# EAGLE design md_ver10.4 (EAGLE 6.4)
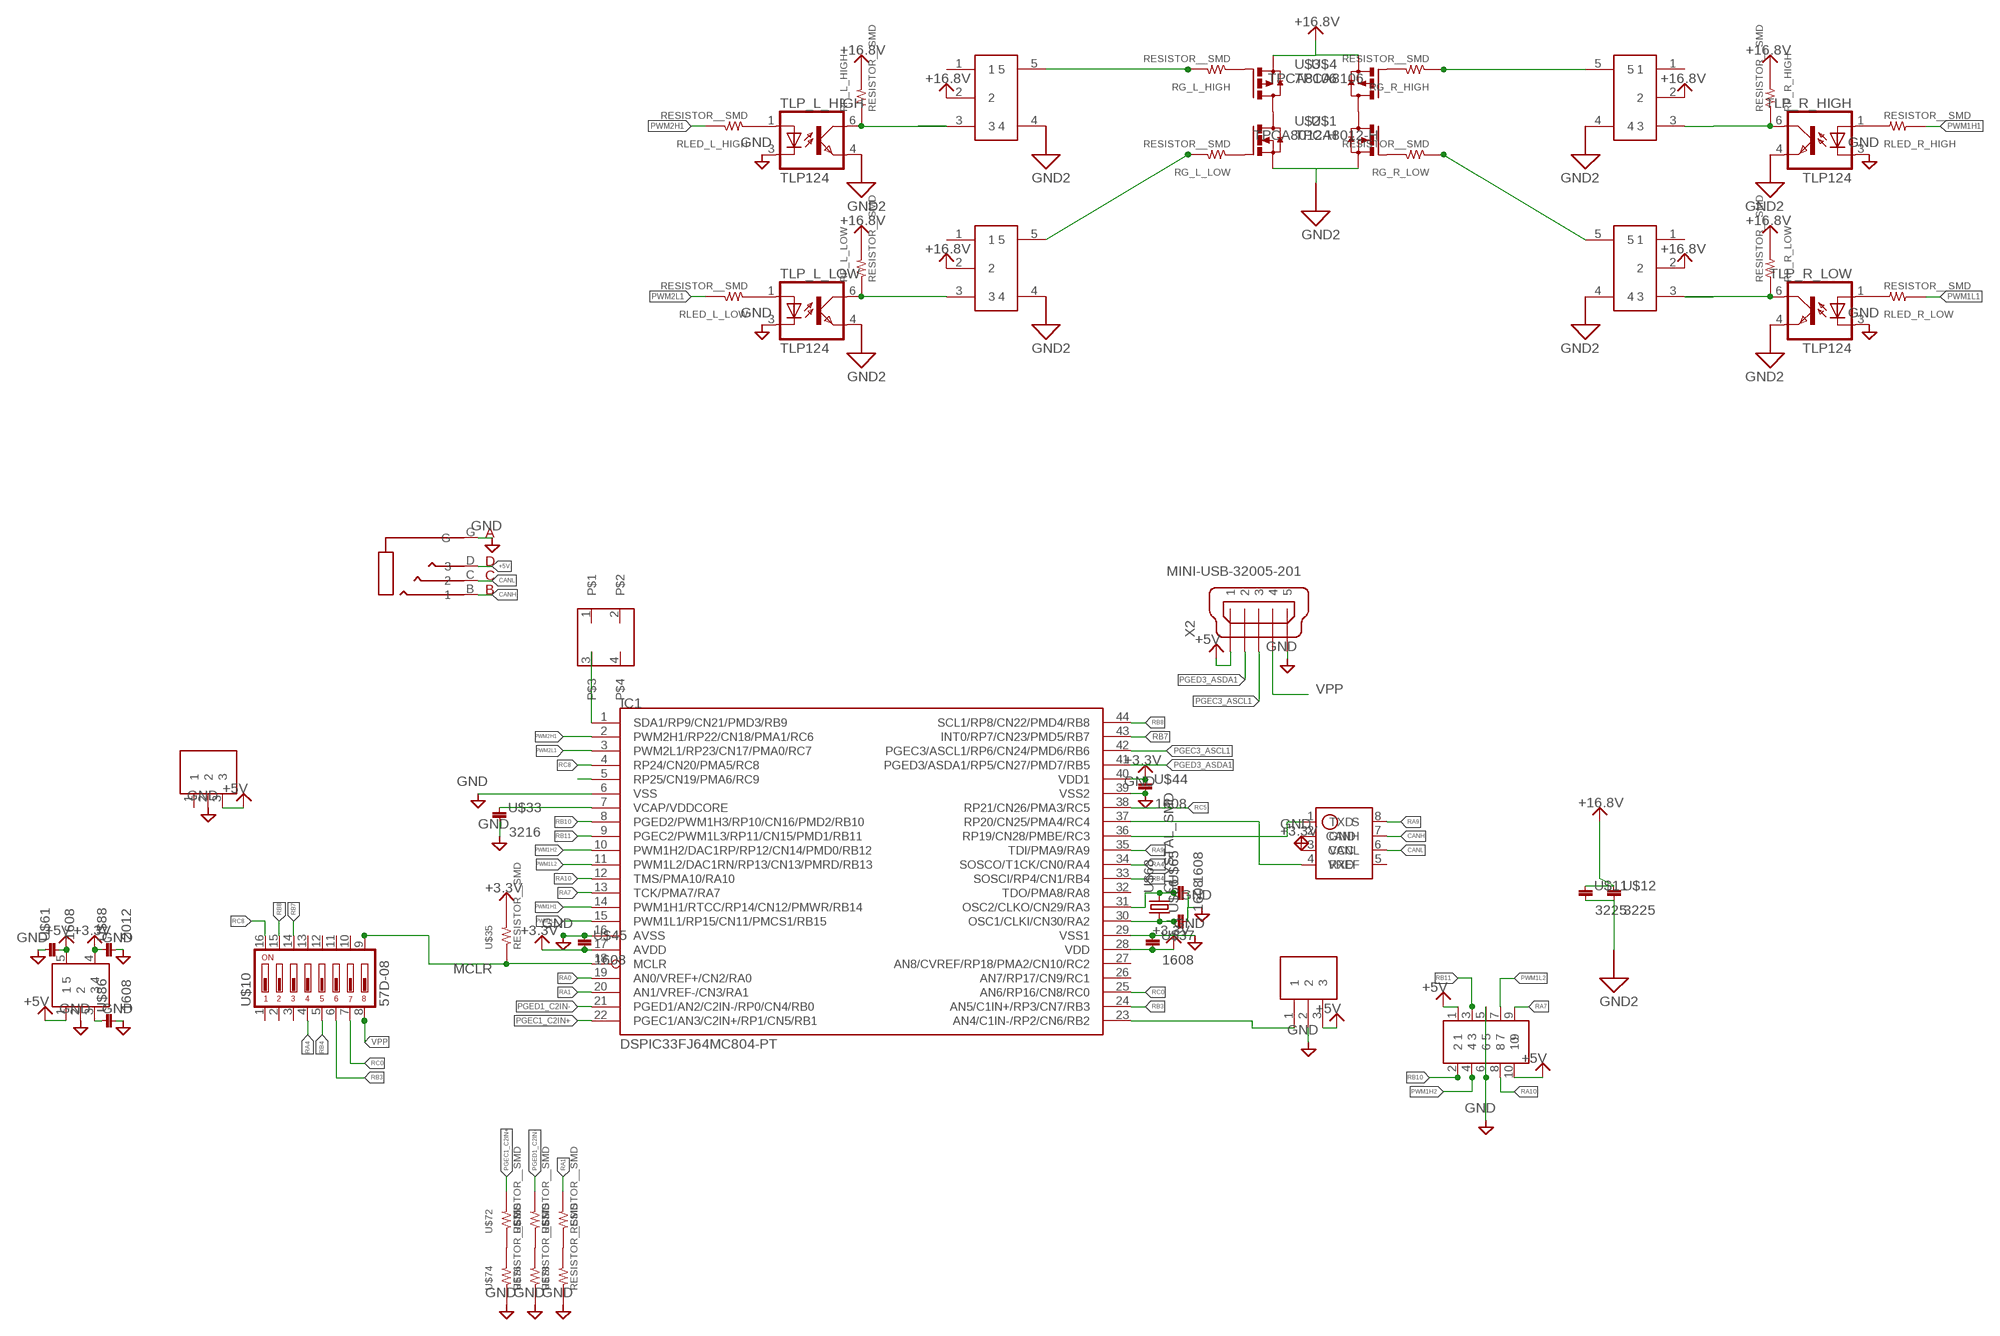
[diagram p0: schematic, sheet 1]

## Parts
IC1  DSPIC33FJ64MC804-PT  [TQFP44]
IC_L_HIGH  MCP1415  [SOT23-5L]
IC_L_LOW  MCP1415  [SOT23-5L]
IC_R_HIGH  MCP1415  [SOT23-5L]
IC_R_LOW  MCP1415  [SOT23-5L]
RG_L_HIGH  RESISTOR__SMD  [1608]
RG_L_LOW  RESISTOR__SMD  [1608]
RG_R_HIGH  RESISTOR__SMD  [1608]
RG_R_LOW  RESISTOR__SMD  [1608]
RLED_L_HIGH  RESISTOR__SMD  [1608]
RLED_L_LOW  RESISTOR__SMD  [1608]
RLED_R_HIGH  RESISTOR__SMD  [1608]
RLED_R_LOW  RESISTOR__SMD  [1608]
RP_L_HIGH  RESISTOR__SMD  [1608]
RP_L_LOW  RESISTOR__SMD  [1608]
RP_R_HIGH  RESISTOR__SMD  [1608]
RP_R_LOW  RESISTOR__SMD  [1608]
TLP_L_HIGH  TLP124  [11−4C1]
TLP_L_LOW  TLP124  [11−4C1]
TLP_R_HIGH  TLP124  [11−4C1]
TLP_R_LOW  TLP124  [11−4C1]
U$1  TPCA8012-H  [2-5Q1A]
U$2  TPCA8012-H  [2-5Q1A]
U$3  TPCA8106  [2-5Q1A]
U$4  TPCA8106  [2-5Q1A]
U$7  ＰＬ－ＩＲＭ  [ＰＬ－ＩＲＭ]
U$8  Ｒ－７８Ｅ５．０  [Ｒ－７８Ｅ５．０]
U$9  TAR5SB  [SSOP5-P-0.95]
U$10  57D-08  [57D]
U$11  3225  [3225]
U$12  3225  [3225]
U$15  PIN_HEADER_52  [PIN_HEADER_5*2]
U$33  3216  [3216]
U$35  RESISTOR__SMD  [1608]
U$37  1608  [1608]
U$44  1608  [1608]
U$45  1608  [1608]
U$61  1608  [1608]
U$64  AUDIO4  [AUDIO4_MJ]
U$65  1608  [1608]
U$66  1608  [1608]
U$68  CLYSTAL_SMD  [CRYSTAL_SMD]
U$69  TACT  [TL1105]
U$72  RESISTOR__SMD  [1608]
U$74  RESISTOR__SMD  [1608]
U$75  RESISTOR__SMD  [1608]
U$76  RESISTOR__SMD  [1608]
U$77  RESISTOR__SMD  [1608]
U$78  RESISTOR__SMD  [1608]
U$82  SN65HVD1050  [SOIC8]
U$86  1608  [1608]
U$88  2012  [2012]
X2  MINI-USB-32005-201  [32005-201]

## Nets
+3.3V: IC1.17(AVDD) IC1.28(VDD) IC1.40(VDD1) U$9.4 U$35.2 U$37.P$2 U$44.P$1 U$45.P$2 U$82.3(VCC) U$88.1
+5V: U$7.3 U$8.3 U$9.1 U$9.5 U$15.1 U$15.10 U$61.P$2 U$64.D X2.1
+16.8V: IC_L_HIGH.2 IC_L_LOW.2 IC_R_HIGH.2 IC_R_LOW.2 RP_L_HIGH.2 RP_L_LOW.2 RP_R_HIGH.2 RP_R_LOW.2 U$3.1(S) U$3.2(S) U$3.3(S) U$4.1(S) U$4.2(S) U$4.3(S) U$11.P$1 U$12.P$1
CANH: U$64.B U$82.7(CANH)
CANL: U$64.C U$82.6(CANL)
GND: IC1.6(VSS) IC1.16(AVSS) IC1.29(VSS1) IC1.39(VSS2) TLP_L_HIGH.3(C) TLP_L_LOW.3(C) TLP_R_HIGH.3(C) TLP_R_LOW.3(C) U$7.2 U$8.2 U$9.2 U$15.5 U$15.6 U$33.P$2 U$37.P$1 U$44.P$2 U$45.P$1 U$61.P$1 U$64.G U$65.P$2 U$66.P$2 U$74.1 U$76.1 U$78.1 U$82.2(GND) U$86.P$2 U$88.2 X2.5
GND2: IC_L_HIGH.4 IC_L_LOW.4 IC_R_HIGH.4 IC_R_LOW.4 TLP_L_HIGH.4(EMIT) TLP_L_LOW.4(EMIT) TLP_R_HIGH.4(EMIT) TLP_R_LOW.4(EMIT) U$1.1(S) U$1.2(S) U$1.3(S) U$2.1(S) U$2.2(S) U$2.3(S) U$11.P$2 U$12.P$2
M1: U$2.5(D) U$2.6(D) U$2.7(D) U$2.8(D) U$3.5(D) U$3.6(D) U$3.7(D) U$3.8(D)
M2: U$1.5(D) U$1.6(D) U$1.7(D) U$1.8(D) U$4.5(D) U$4.6(D) U$4.7(D) U$4.8(D)
MCLR: IC1.18(MCLR) U$10.9 U$35.1
N$1: RG_L_LOW.1 U$2.4(G)
N$2: U$9.3 U$86.P$1
N$3: RLED_L_LOW.1 TLP_L_LOW.1(A)
N$4: RG_R_LOW.2 U$1.4(G)
N$5: IC_L_LOW.5 RG_L_LOW.2
N$6: IC_L_LOW.3 RP_L_LOW.1 TLP_L_LOW.6(COL)
N$7: IC_R_LOW.5 RG_R_LOW.1
N$9: RLED_R_LOW.1 TLP_R_LOW.1(A)
N$11: IC_L_HIGH.3 RP_L_HIGH.1 TLP_L_HIGH.6(COL)
N$12: RLED_L_HIGH.1 TLP_L_HIGH.1(A)
N$14: IC_L_HIGH.5 RG_L_HIGH.2
N$15: IC_R_HIGH.3 RP_R_HIGH.1 TLP_R_HIGH.6(COL)
N$16: RLED_R_HIGH.1 TLP_R_HIGH.1(A)
N$17: IC1.23(AN4/C1IN-/RP2/CN6/RB2) U$7.1
N$18: IC_R_HIGH.5 RG_R_HIGH.1
N$19: RG_L_HIGH.1 U$3.4(G)
N$20: RG_R_HIGH.2 U$4.4(G)
N$21: U$72.1 U$74.2
N$22: IC1.30(OSC1/CLKI/CN30/RA2) U$66.P$1 U$68.1
N$23: IC1.31(OSC2/CLKO/CN29/RA3) U$65.P$1 U$68.2
N$24: U$75.1 U$76.2
N$25: U$77.1 U$78.2
N$26: IC1.1(SDA1/RP9/CN21/PMD3/RB9) U$69.3
N$27: IC1.36(RP19/CN28/PMBE/RC3) U$82.1(TXD)
N$28: IC1.5(RP25/CN19/PMA6/RC9)
N$30: IC1.37(RP20/CN25/PMA4/RC4) U$82.4(RXD)
PGEC1_C2IN+: IC1.22(PGEC1/AN3/C2IN+/RP1/CN5/RB1) U$72.2
PGEC3_ASCL1: IC1.42(PGEC3/ASCL1/RP6/CN24/PMD6/RB6) X2.3
PGED1_C2IN-: IC1.21(PGED1/AN2/C2IN-/RP0/CN4/RB0) U$75.2
PGED3_ASDA1: IC1.41(PGED3/ASDA1/RP5/CN27/PMD7/RB5) X2.2
PWM1H1: IC1.14(PWM1H1/RTCC/RP14/CN12/PMWR/RB14) RLED_R_HIGH.2
PWM1H2: IC1.10(PWM1H2/DAC1RP/RP12/CN14/PMD0/RB12) U$15.4
PWM1L1: IC1.15(PWM1L1/RP15/CN11/PMCS1/RB15) RLED_R_LOW.2
PWM1L2: IC1.11(PWM1L2/DAC1RN/RP13/CN13/PMRD/RB13) U$15.7
PWM2H1: IC1.2(PWM2H1/RP22/CN18/PMA1/RC6) RLED_L_HIGH.2
PWM2L1: IC1.3(PWM2L1/RP23/CN17/PMA0/RC7) RLED_L_LOW.2
RA0: IC1.19(AN0/VREF+/CN2/RA0)
RA1: IC1.20(AN1/VREF-/CN3/RA1) U$77.2
RA4: IC1.34(SOSCO/T1CK/CN0/RA4) U$10.4
RA7: IC1.13(TCK/PMA7/RA7) U$15.9
RA9: IC1.35(TDI/PMA9/RA9) U$82.8(S)
RA10: IC1.12(TMS/PMA10/RA10) U$15.8
RB3: IC1.24(AN5/C1IN+/RP3/CN7/RB3) U$10.6
RB4: IC1.33(SOSCI/RP4/CN1/RB4) U$10.5
RB7: IC1.43(INT0/RP7/CN23/PMD5/RB7) U$10.14
RB8: IC1.44(SCL1/RP8/CN22/PMD4/RB8) U$10.15
RB10: IC1.8(PGED2/PWM1H3/RP10/CN16/PMD2/RB10) U$15.2
RB11: IC1.9(PGEC2/PWM1L3/RP11/CN15/PMD1/RB11) U$15.3
RC0: IC1.25(AN6/RP16/CN8/RC0) U$10.7
RC5: IC1.38(RP21/CN26/PMA3/RC5)
RC8: IC1.4(RP24/CN20/PMA5/RC8) U$10.16
TLP_R_LOW: IC_R_LOW.3 RP_R_LOW.1 TLP_R_LOW.6(COL)
VCAP/VDDCORE: IC1.7(VCAP/VDDCORE) U$33.P$1
VPP: U$10.8 X2.4
Unconnected: IC1.26(AN7/RP17/CN9/RC1) IC1.27(AN8/CVREF/RP18/PMA2/CN10/RC2) IC1.32(TDO/PMA8/RA8) IC_L_HIGH.1 IC_L_LOW.1 IC_R_HIGH.1 IC_R_LOW.1 U$8.1 U$10.1 U$10.2 U$10.3 U$10.10 U$10.11 U$10.12 U$10.13 U$69.1 U$69.2 U$69.4 U$82.5(VREF)

## Library data of the parts
IC1 = microchip-dspic33fjxxmc:DSPIC33FJ64MC804: dsPIC33FJ32MC302/304, dsPIC33FJ64MCX02/X04, AND dsPIC33FJ128MCX02/X04 High-Performance, 16-bit Digital Signal Controllers Package:44 Pin TQFP Operating Range: * Up to 40 MIPS operation (at 3.0V -3.6V): - Industrial temperature range (-40°C to +85°C) - Extended temperature range (-40°C to +125°C) High-Performance DSC CPU: * Modified Harvard architecture * C compiler optimized instruction set * 16-bit wide data path * 24-bit wide instructions * Linear program memory addressing up to 4M instruction words * Linear data memory addressing up to 64 Kbytes * 83 base instructions: mostly 1 word/1 cycle * Two 40-bit accumulators with rounding and saturation options * Flexible and powerful addressing modes: - Indirect - Modulo - Bit-Reversed * Software stack * 16 x 16 fractional/integer multiply operations * 32/16 and 16/16 divide operations * Single-cycle multiply and accumulate: - Accumulator write back for DSP operations - Dual data fetch * Up to ±16-bit shifts for up to 40-bit data Direct Memory Access (DMA): * 8-channel hardware DMA * Up to 2 Kbytes dual ported DMA buffer area (DMA RAM) to store data transferred via DMA: - Allows data transfer between RAM and a peripheral while CPU is executing code (no cycle stealing) * Most peripherals support DMA Timers/Capture/Compare/PWM: * Timer/Counters, up to five 16-bit timers: - Can pair up to make two 32-bit timers - One timer runs as a Real-Time Clock with an external 32.768 kHz oscillator - Programmable prescaler * Input Capture (up to four channels): - Capture on up, down or both edges - 16-bit capture input functions - 4-deep FIFO on each capture * Output Compare (up to four channels): - Single or Dual 16-bit Compare mode - 16-bit Glitchless PWM mode * Hardware Real-Time Clock/Calendar (RTCC): - Provides clock, calendar, and alarm functions Interrupt Controller: * 5-cycle latency * Up to 53 available interrupt sources * Up to three external interrupts * Seven programmable priority levels * Five processor exceptions Digital I/O: * Peripheral pin Select functionality * Up to 35 programmable digital I/O pins * Wake-up/Interrupt-on-Change for up to 31 pins * Output pins can drive from 3.0V to 3.6V * Up to 5V output with open drain configuration * All digital input pins are 5V tolerant * 4 mA sink on all I/O pins On-Chip Flash and SRAM: * Flash program memory (up to 128 Kbytes) * Data SRAM (up to 16 Kbytes) * Boot, Secure, and General Security for program Flash System Management: * Flexible clock options: - External, crystal, resonator, internal RC - Fully integrated Phase-Locked Loop (PLL) - Extremely low jitter PLL * Power-up Timer * Oscillator Start-up Timer/Stabilizer * Watchdog Timer with its own RC oscillator * Fail-Safe Clock Monitor * Reset by multiple sources Power Management: * On-chip 2.5V voltage regulator * Switch between clock sources in real time * Idle, Sleep, and Doze modes with fast wake-up Analog-to-Digital Converters (ADCs): * 10-bit, 1.1 Msps or 12-bit, 500 Ksps conversion: - Two and four simultaneous samples (10-bit ADC) - Up to nine input channels with auto-scanning - Conversion start can be manual or synchronized with one of four trigger sources - Conversion possible in Sleep mode - ±2 LSb max integral nonlinearity - ±1 LSb max differential nonlinearity Audio Digital-to-Analog Converter (DAC): - 16-bit Dual Channel DAC module - 100 Ksps maximum sampling rate - Second-Order Digital Delta-Sigma Modulator Comparator Module: * Two analog comparators with programmable input/output configuration CMOS Flash Technology: * Low-power, high-speed Flash technology * Fully static design * 3.3V (±10%) operating voltage * Industrial and Extended temperature * Low power consumption Motor Control Peripherals: * 6-channel 16-bit Motor Control PWM: - Three duty cycle generators - Independent or Complementary mode - Programmable dead-time and output polarity - Edge-aligned or center-aligned - Manual output override control - One Fault input - Trigger for ADC conversions - PWM frequency for 16-bit resolution (@ 40 MIPS) = 1220 Hz for Edge-Aligned mode, 610 Hz for Center-Aligned mode - PWM frequency for 11-bit resolution (@ 40 MIPS) = 39.1 kHz for Edge-Aligned mode, 19.55 kHz for Center-Aligned mode * 2-channel 16-bit Motor Control PWM: - One duty cycle generator - Independent or Complementary mode - Programmable dead time and output polarity - Edge-aligned or center-aligned - Manual output override control - One Fault input - Trigger for ADC conversions - PWM frequency for 16-bit resolution (@ 40 MIPS) = 1220 Hz for Edge-Aligned mode, 610 Hz for Center-Aligned mode - PWM frequency for 11-bit resolution (@ 40 MIPS) = 39.1 kHz for Edge-Aligned mode, 19.55 kHz for Center-Aligned mode * 2-Quadrature Encoder Interface module: - Phase A, Phase B, and index pulse input - 16-bit up/down position counter - Count direction status - Position Measurement (x2 and x4) mode - Programmable digital noise filters on inputs - Alternate 16-bit Timer/Counter mode - Interrupt on position counter rollover/underflow
IC_L_HIGH IC_L_LOW IC_R_HIGH IC_R_LOW = 04_IC:MCP1415
RG_L_HIGH RG_L_LOW RG_R_HIGH RG_R_LOW RLED_L_HIGH RLED_L_LOW RLED_R_HIGH RLED_R_LOW RP_L_HIGH RP_L_LOW RP_R_HIGH RP_R_LOW U$35 U$72 U$74-U$78 = 01_R:RESISTOR__SMD
TLP_L_HIGH TLP_L_LOW TLP_R_HIGH TLP_R_LOW = 04_IC:TLP124
U$1 U$2 = 06_FET:TPCA8012-H
U$3 U$4 = 06_FET:TPCA8106
U$7 = 04_IC:ＰＬ－ＩＲＭ
U$8 = 04_IC:Ｒ－７８Ｅ５．０
U$9 = 04_IC:TAR5SB
U$10 = switch:57D-08
U$11 U$12 = 02_C:3225
U$15 = 08_CONECTOR:PIN_HEADER_5*2
U$33 = 02_C:3216
U$37 U$44 U$45 U$61 U$65 U$66 U$86 = 02_C:1608
U$64 = 08_CONECTOR:AUDIO4
U$68 = CRYSTAL:CLYSTAL_SMD
U$69 = switch:TACT
U$82 = 04_IC:SN65HVD1050
U$88 = 02_C:2012
X2 = con-cypressindustries:MINI-USB-: MINI USB-B Conector Source: www.cypressindustries.com; OC_FARNELL: unknown; OC_NEWARK: unknown

## Board
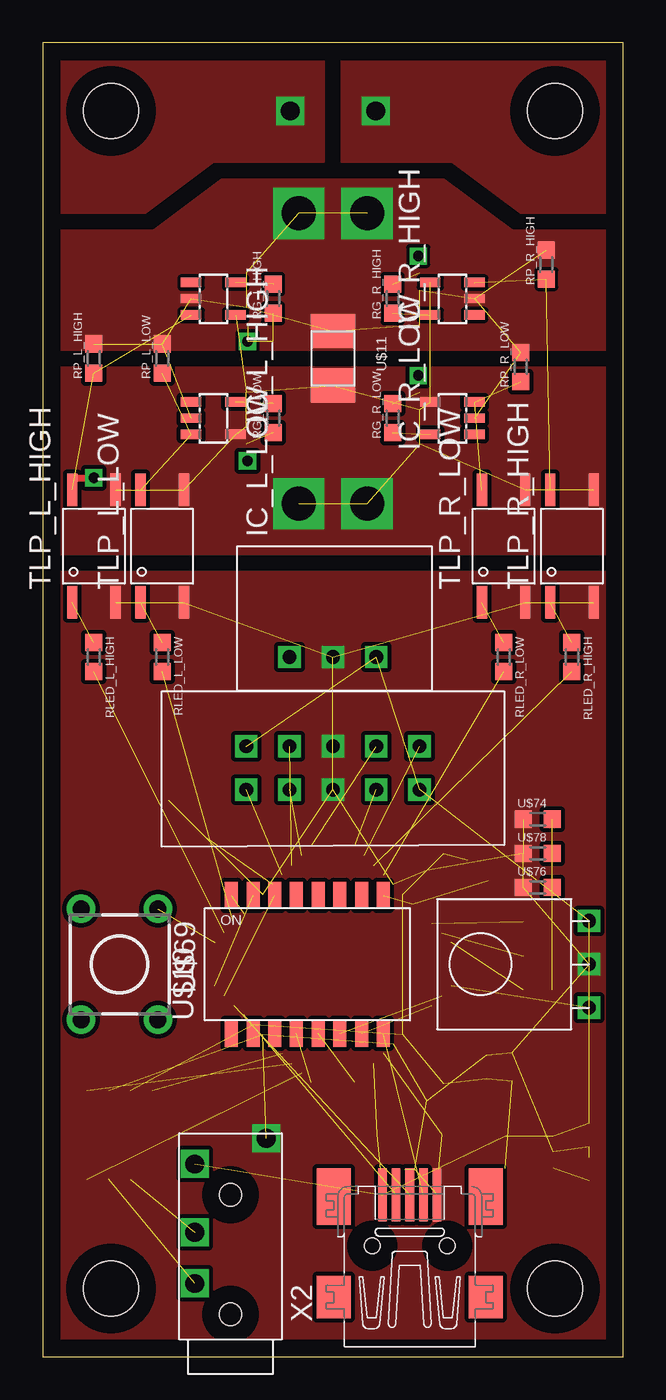
[diagram p1: board, top side]
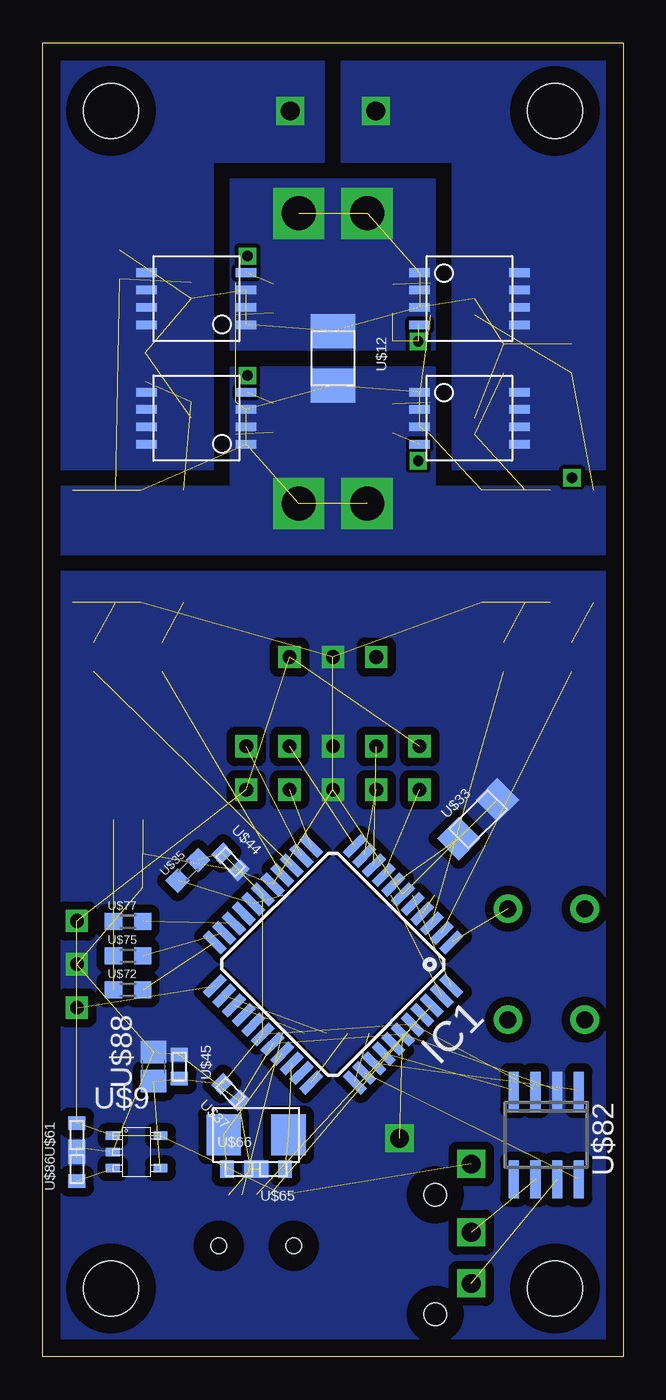
[diagram p2: board, bottom side, seen from below]

Size 34 x 77 mm. Coordinates in mm from the lower left corner, seen from the top.
Outline: 0,0 34,0 34,77 0,77 0,0
Copper layers (1*16): Top 0.035mm / dielectric 1.5mm / Bottom 0.035mm
Design rules "default": minimum track width 10mil, minimum drill 24mil, track to track 8mil, track to pad 8mil, pad to pad 8mil, via to via 8mil, smd to smd 8mil, copper to edge 40mil, drill to drill 8mil, minimum pad ring 10mil, minimum via ring 8mil, stop-mask expansion 4mil, vias tented up to drill 0mil, thermal gap 10mil
Holes 3.2 mm at 4,4 30,4 4,73 30,73

### Footprints (pad centres in the part's own frame; a part is rotated, then mirrored left to right if it is on the bottom)
TQFP44 = smd 1.5 x 0.5: 1 -5.8,4; 2 -5.8,3.2; 3 -5.8,2.4; 4 -5.8,1.6; 5 -5.8,0.8; 6 -5.8,0; 7 -5.8,-0.8; 8 -5.8,-1.6; 9 -5.8,-2.4; 10 -5.8,-3.2; 11 -5.8,-4; 23 5.8,-4; 24 5.8,-3.2; 25 5.8,-2.4; 26 5.8,-1.6; 27 5.8,-0.8; 28 5.8,0; 29 5.8,0.8; 30 5.8,1.6; 31 5.8,2.4; 32 5.8,3.2; 33 5.8,4 | smd 0.5 x 1.5: 12 -4,-5.8; 13 -3.2,-5.8; 14 -2.4,-5.8; 15 -1.6,-5.8; 16 -0.8,-5.8; 17 0,-5.8; 18 0.8,-5.8; 19 1.6,-5.8; 20 2.4,-5.8; 21 3.2,-5.8; 22 4,-5.8; 34 4,5.8; 35 3.2,5.8; 36 2.4,5.8; 37 1.6,5.8; 38 0.8,5.8; 39 0,5.8; 40 -0.8,5.8; 41 -1.6,5.8; 42 -2.4,5.8; 43 -3.2,5.8; 44 -4,5.8
SOT23-5L = smd 0.55 x 1.2: 1 -0.95,-1.3; 2 0,-1.3; 3 0.95,-1.3; 4 0.95,1.3; 5 -0.95,1.3
1608 = smd 1 x 1: 1 -0.85,0; 2 0.85,0
11−4C1 = smd 0.6 x 1.9: 1 -1.27,-3.3; 3 1.27,-3.3; 4 1.27,3.3; 6 -1.27,3.3
2-5Q1A = smd 0.5 x 1.2: 1 -1.524,-2.921; 2 -0.508,-2.921; 3 0.508,-2.921; 4 1.524,-2.921; 5 1.524,2.921; 6 0.508,2.921; 7 -0.508,2.921; 8 -1.524,2.921
ＰＬ－ＩＲＭ = drill 0.8 square: 1 -2.54,0; 2 0,0; 3 2.54,0
Ｒ－７８Ｅ５．０ = drill 0.8 square: 1 -2.54,0; 2 0,0; 3 2.54,0
SSOP5-P-0.95 = smd 0.5 x 0.8: 1 -0.95,-1.4; 2 0,-1.4; 3 0.95,-1.4; 4 0.95,1.4; 5 -0.95,1.4
57D = smd 0.76 x 1.58: 1 -4.445,-4.045; 2 -3.175,-4.045; 3 -1.905,-4.045; 4 -0.635,-4.045; 5 0.635,-4.045; 6 1.905,-4.045; 7 3.175,-4.045; 8 4.445,-4.045; 9 4.445,4.045; 10 3.175,4.045; 11 1.905,4.045; 12 0.635,4.045; 13 -0.635,4.045; 14 -1.905,4.045; 15 -3.175,4.045; 16 -4.445,4.045
3225 = smd 2 x 2.6: P$1 -1.6,0; P$2 1.6,0
PIN_HEADER_5*2 = drill 0.8 square: 1 -5.08,1.27; 2 -5.08,-1.27; 3 -2.54,1.27; 4 -2.54,-1.27; 5 0,1.27; 6 0,-1.27; 7 2.54,1.27; 8 2.54,-1.27; 9 5.08,1.27; 10 5.08,-1.27
3216 = smd 1.8 x 1.8: P$1 -1.6,0; P$2 1.6,0
1608' = smd 0.8 x 1: P$1 -0.7,0; P$2 0.7,0
AUDIO4_MJ = drill 1.1 square: B 3.3,2.1; C 6.3,2.1; D 10.3,2.1; G 11.8,-2.1 | hole 1.3: 1.5,0; 8.5,0
CRYSTAL_SMD = smd 2 x 2.4: 1 -1.9,0; 2 1.9,0
TL1105 = drill 1 pad 1.676: 1 -2.25,3.25; 2 2.25,3.25; 3 -2.25,-3.25; 4 2.25,-3.25
SOIC8 = smd 0.6 x 2.2: 1 -1.905,-2.6; 2 -0.635,-2.6; 3 0.635,-2.6; 4 1.905,-2.6; 5 1.905,2.6; 6 0.635,2.6; 7 -0.635,2.6; 8 -1.905,2.6
2012 = smd 1.3 x 1.5: 1 -0.85,0; 2 0.85,0
32005-201 = smd 3.1 x 0.5: 1 3,1.6; 2 3,0.8; 3 3,0; 4 3,-0.8; 5 3,-1.6 | smd 2.5 x 2: M1 -3,-4.45; M2 -3,4.45 | smd 3.3 x 2: M3 2.9,4.45; M4 2.9,-4.45 | hole 0.9: 0,2.2; 0,-2.2

### Placement (x,y rotation side)
IC1  17,23 225 bottom
IC_L_HIGH  10,62 270 top
IC_L_LOW  10,55 270 top
IC_R_HIGH  24,62 90 top
IC_R_LOW  24,55 90 top
RG_L_HIGH  13.5,62 90 top
RG_L_LOW  13.5,55 90 top
RG_R_HIGH  20.5,62 90 top
RG_R_LOW  20.5,55 90 top
RLED_L_HIGH  3,41 270 top
RLED_L_LOW  7,41 270 top
RLED_R_HIGH  31,41 270 top
RLED_R_LOW  27,41 270 top
RP_L_HIGH  3,58.5 90 top
RP_L_LOW  7,58.5 90 top
RP_R_HIGH  29.5,64 90 top
RP_R_LOW  28,58 90 top
TLP_L_HIGH  3,47.5 0 top
TLP_L_LOW  7,47.5 0 top
TLP_R_HIGH  31,47.5 0 top
TLP_R_LOW  27,47.5 0 top
U$1  25,55 90 bottom
U$2  9,55 270 bottom
U$3  9,62 270 bottom
U$4  25,62 90 bottom
U$7  32,23 90 top
U$8  17,41 0 top
U$9  28.5,12 270 bottom
U$10  15.5,23 0 top
U$11  17,58.5 270 top
U$12  17,58.5 270 bottom
U$15  17,34.5 0 top
U$33  8.5,31.5 45 bottom
U$35  25.5,28.5 45 bottom
U$37  1608  [1608']  23,15.5 135 bottom
U$44  1608  [1608']  23,29 315 bottom
U$45  1608  [1608']  26,17 270 bottom
U$61  1608  [1608']  32,13 90 bottom
U$64  11,1 90 top
U$65  1608  [1608']  20.5,11 180 bottom
U$66  1608  [1608']  22.5,11 0 bottom
U$68  21.5,13 0 bottom
U$69  4.5,23 180 top
U$72  29,21.5 0 bottom
U$74  29,31.5 0 top
U$75  29,23.5 0 bottom
U$76  29,27.5 0 top
U$77  29,25.5 0 bottom
U$78  29,29.5 0 top
U$82  4.5,13 180 bottom
U$86  1608  [1608']  32,11 90 bottom
U$88  27.5,17 90 bottom
X2  21.5,6.5 90 top

### Tracks (layer width: path | path; a pad name or v marks a point on that pad's centre or on a via)
+3.3V  (9 unrouted)
+5V  (8 unrouted)
+16.8V  (via drill 2)  (17 unrouted)
  other vias: 19,67 15,67
  pour Bottom (isolate 0.254, rank 2, no thermals): 11,69 23,69 23,59 11,59
  pour Top (no thermals): 1,59 33,59 33,66 27.5,66 23.5,69 10.5,69 6.5,66 1,66
CANH  (1 unrouted)
CANL  (1 unrouted)
GND  (27 unrouted)
  pour Top (isolate 0.254, no thermals): 1,46 33,46 33,1 1,1
  pour Bottom (isolate 0.5, rank 2, no thermals): 1,46 33,46 33,1 1,1
GND2  (via drill 2)  (17 unrouted)
  other vias: 19,50 15,50
  pour Bottom (isolate 0.1, no thermals): 33,47 1,47 1,51 11,51 11,58 23,58 23,51 33,51
  pour Top (isolate 0.254, no thermals): 1,58 33,58 33,47 1,47
M1  (via drill 1.1)
  other vias: 14.5,73
  pour Bottom (isolate 0.254, no thermals): 1,76 16.5,76 16.5,70 10,70 10,52 1,52
  pour Top (no thermals): 1,76 16.5,76 16.5,70 10,70 6,67 1,67
M2  (via drill 1.1)
  other vias: 19.5,73
  pour Bottom (isolate 0.254, no thermals): 24,52 24,70 17.5,70 17.5,76 33,76 33,52
  pour Top (no thermals): 17.5,76 33,76 33,67 28,67 24,70 17.5,70
MCLR  (2 unrouted)
N$1  (1 unrouted)
N$2  (1 unrouted)
N$3  (1 unrouted)
N$4  (1 unrouted)
N$5  (1 unrouted)
N$6  (2 unrouted)
N$7  (1 unrouted)
N$8  (via drill 0.6)
  other vias: 22,64.5
N$9  (1 unrouted)
N$10  (via drill 0.6)
  other vias: 22,57.5
N$11  (2 unrouted)
N$12  (1 unrouted)
N$13  (via drill 0.6)
  other vias: 12,52.5
N$14  (1 unrouted)
N$15  (2 unrouted)
N$16  (1 unrouted)
N$17  (1 unrouted)
N$18  (1 unrouted)
N$19  (via drill 0.6)  (3 unrouted)
  Bottom 0.406: U$3.4 12,60.48
  other vias: 12,59.5
N$20  (1 unrouted)
N$21  (1 unrouted)
N$22  (2 unrouted)
N$23  (2 unrouted)
N$24  (1 unrouted)
N$25  (1 unrouted)
N$26  (1 unrouted)
N$27  (1 unrouted)
N$29  (via drill 0.6)
  Top 0.406: 2,51.5 v3,51.5
N$30  (1 unrouted)
PGEC1_C2IN+  (1 unrouted)
PGEC3_ASCL1  (1 unrouted)
PGED1_C2IN-  (1 unrouted)
PGED3_ASDA1  (1 unrouted)
PWM1H1  (1 unrouted)
PWM1H2  (1 unrouted)
PWM1L1  (1 unrouted)
PWM1L2  (1 unrouted)
PWM2H1  (1 unrouted)
PWM2L1  (1 unrouted)
RA1  (1 unrouted)
RA4  (1 unrouted)
RA7  (1 unrouted)
RA9  (1 unrouted)
RA10  (1 unrouted)
RB3  (1 unrouted)
RB4  (1 unrouted)
RB7  (1 unrouted)
RB8  (1 unrouted)
RB10  (1 unrouted)
RB11  (1 unrouted)
RC0  (1 unrouted)
RC8  (1 unrouted)
TLP_R_LOW  (2 unrouted)
VCAP/VDDCORE  (1 unrouted)
VPP  (1 unrouted)